# Altium schematic sheet CPU.SchDoc: CPU
size 420 x 297 mm; DocumentNumber: 2; SheetNumber: 3; SheetTotal: 15
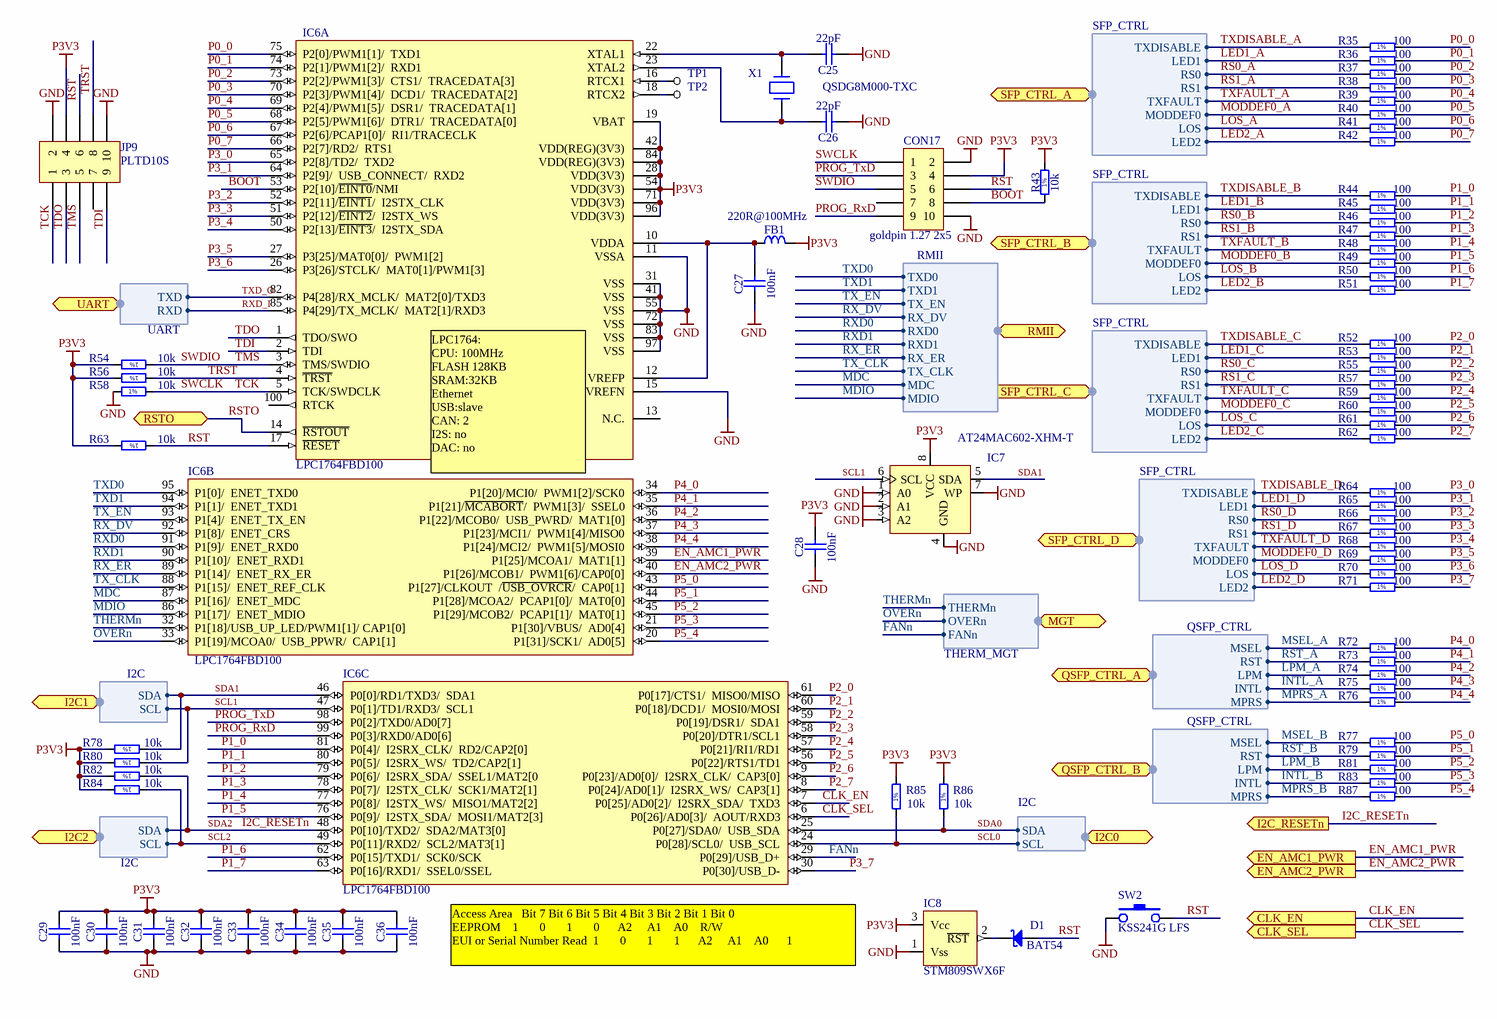
[diagram p0: CPU.SchDoc]

## Parts
C25  22pF  [CAPC1005X55N]
C26  22pF  [CAPC1005X55N]
C27  100nF  [CAPC0603X33N]
C28  100nF  [CAPC0603X33N]
C29  100nF  [CAPC0603X33N]
C30  100nF  [CAPC0603X33N]
C31  100nF  [CAPC0603X33N]
C32  100nF  [CAPC0603X33N]
C33  100nF  [CAPC0603X33N]
C34  100nF  [CAPC0603X33N]
C35  100nF  [CAPC0603X33N]
C36  100nF  [CAPC0603X33N]
CON17  goldpin 1.27 2x5  [CON_2x5_MINI]
D1  BAT54  [SOT95P240X130-3N]
FB1  220R@100MHz  [INDC2012X105N]
IC6  LPC1764FBD100  [LQFP100-LPC]  (parts A,B,C of 3)
IC7  AT24MAC602-XHM-T  [TSSOP-8]
IC8  STM809SWX6F  [SOT-23]
JP9  PLTD10S  [PLTD10S]
R35  100  [RESC1005X40N]
R36  100  [RESC1005X40N]
R37  100  [RESC1005X40N]
R38  100  [RESC1005X40N]
R39  100  [RESC1005X40N]
R40  100  [RESC1005X40N]
R41  100  [RESC1005X40N]
R42  100  [RESC1005X40N]
R43  10k  [RESC1005X40N]
R44  100  [RESC1005X40N]
R45  100  [RESC1005X40N]
R46  100  [RESC1005X40N]
R47  100  [RESC1005X40N]
R48  100  [RESC1005X40N]
R49  100  [RESC1005X40N]
R50  100  [RESC1005X40N]
R51  100  [RESC1005X40N]
R52  100  [RESC1005X40N]
R53  100  [RESC1005X40N]
R54  10k  [RESC1005X40N]
R55  100  [RESC1005X40N]
R56  10k  [RESC1005X40N]
R57  100  [RESC1005X40N]
R58  10k  [RESC1005X40N]
R59  100  [RESC1005X40N]
R60  100  [RESC1005X40N]
R61  100  [RESC1005X40N]
R62  100  [RESC1005X40N]
R63  10k  [RESC1005X40N]
R64  100  [RESC1005X40N]
R65  100  [RESC1005X40N]
R66  100  [RESC1005X40N]
R67  100  [RESC1005X40N]
R68  100  [RESC1005X40N]
R69  100  [RESC1005X40N]
R70  100  [RESC1005X40N]
R71  100  [RESC1005X40N]
R72  100  [RESC1005X40N]
R73  100  [RESC1005X40N]
R74  100  [RESC1005X40N]
R75  100  [RESC1005X40N]
R76  100  [RESC1005X40N]
R77  100  [RESC1005X40N]
R78  10k  [RESC1005X40N]
R79  100  [RESC1005X40N]
R80  10k  [RESC1005X40N]
R81  100  [RESC1005X40N]
R82  10k  [RESC1005X40N]
R83  100  [RESC1005X40N]
R84  10k  [RESC1005X40N]
R85  10k  [RESC1005X40N]
R86  10k  [RESC1005X40N]
R87  100  [RESC1005X40N]
SW2  KSS241G LFS  [KSS241G LFS]
TP1  TP  [TP]  (value not drawn)
TP2  TP  [TP]  (value not drawn)
X1  QSDG8M000-TXC  [XTAL_5.0*3.2]

## Ports
CLK_EN (out), CLK_SEL (out), EN_AMC1_PWR (out), EN_AMC2_PWR (out), I2C0 (harness I2C), I2C1 (harness I2C), I2C2 (harness I2C), I2C_RESETn (out), MGT (harness THERM_MGT), QSFP_CTRL_A (harness QSFP_CTRL), QSFP_CTRL_B (harness QSFP_CTRL), RMII (harness RMII), RSTO, SFP_CTRL_A (harness SFP_CTRL), SFP_CTRL_B (harness SFP_CTRL), SFP_CTRL_C (harness SFP_CTRL), SFP_CTRL_D (harness SFP_CTRL), UART (harness UART)

## Harnesses
I2C: SCL, SDA
UART: RXD, TXD
SFP_CTRL: LED1, TXFAULT, TXDISABLE, MODDEF0, RS0, RS1, LOS, LED2
QSFP_CTRL: RST, MPRS, MSEL, LPM, INTL
RMII: TXD0, TXD1, TX_EN, RX_DV, RXD0, RXD1, RX_ER, TX_CLK, MDC, MDIO
THERM_MGT: OVERn, THERMn, FANn

## Nets
GND: C25.1 C26.1 C27.1 C28.1 C29.1 C30.1 C31.1 C32.1 C33.1 C34.1 C35.1 C36.1 CON17.2 CON17.10 IC6.11(VSSA) IC6.15(VREFN) IC6.31(VSS) IC6.41(VSS) IC6.55(VSS) IC6.72(VSS) IC6.83(VSS) IC6.97(VSS) IC7.1(A0) IC7.2(A1) IC7.3(A2) IC7.4(GND) IC7.7(WP) IC8.1(Vss) JP9.2 JP9.10 R58.1 SW2.1
P3V3: C28.2 C29.2 C30.2 C31.2 C32.2 C33.2 C34.2 C35.2 C36.2 CON17.4 FB1.2 IC6.19(VBAT) IC6.28(VDD(3V3)) IC6.42(VDD(REG)(3V3)) IC6.54(VDD(3V3)) IC6.71(VDD(3V3)) IC6.84(VDD(REG)(3V3)) IC6.96(VDD(3V3)) IC7.8(VCC) IC8.3(Vcc) JP9.4 R43.2 R54.2 R56.2 R63.2 R78.2 R80.2 R82.2 R84.2 R85.2 R86.2
BOOT: CON17.8 IC6.53(P2[10]/~{EINT0}/NMI) R43.1
CLK_EN: IC6.7(P0[25]/AD0[2]/__I2SRX_SDA/__TXD3) ; port CLK_EN
CLK_SEL: IC6.6(P0[26]/AD0[3]/__AOUT/RXD3) ; port CLK_SEL
EN_AMC1_PWR: IC6.39(P1[25]/MCOA1/__MAT1[1]) ; port EN_AMC1_PWR
EN_AMC2_PWR: IC6.40(P1[26]/MCOB1/__PWM1[6]/CAP0[0]) ; port EN_AMC2_PWR
FANn: IC6.29(P0[29]/USB_D+) ; port MGT.FANn
I2C_RESETn: IC6.48(P0[10]/TXD2/__SDA2/MAT3[0]) R82.1 ; port I2C_RESETn, port I2C2.SDA  [also labelled SDA2]
INTL_A: R75.1 ; port QSFP_CTRL_A.INTL
INTL_B: R83.1 ; port QSFP_CTRL_B.INTL
LED1_A: R36.1 ; port SFP_CTRL_A.LED1
LED1_B: R45.1 ; port SFP_CTRL_B.LED1
LED1_C: R53.1 ; port SFP_CTRL_C.LED1
LED1_D: R65.1 ; port SFP_CTRL_D.LED1
LED2_A: R42.1 ; port SFP_CTRL_A.LED2
LED2_B: R51.1 ; port SFP_CTRL_B.LED2
LED2_C: R62.1 ; port SFP_CTRL_C.LED2
LED2_D: R71.1 ; port SFP_CTRL_D.LED2
LOS_A: R41.1 ; port SFP_CTRL_A.LOS
LOS_B: R50.1 ; port SFP_CTRL_B.LOS
LOS_C: R61.1 ; port SFP_CTRL_C.LOS
LOS_D: R70.1 ; port SFP_CTRL_D.LOS
LPM_A: R74.1 ; port QSFP_CTRL_A.LPM
LPM_B: R81.1 ; port QSFP_CTRL_B.LPM
MDC: IC6.87(P1[16]/__ENET_MDC) ; port RMII.MDC
MDIO: IC6.86(P1[17]/__ENET_MDIO) ; port RMII.MDIO
MODDEF0_A: R40.1 ; port SFP_CTRL_A.MODDEF0
MODDEF0_B: R49.1 ; port SFP_CTRL_B.MODDEF0
MODDEF0_C: R60.1 ; port SFP_CTRL_C.MODDEF0
MODDEF0_D: R69.1 ; port SFP_CTRL_D.MODDEF0
MPRS_A: R76.1 ; port QSFP_CTRL_A.MPRS
MPRS_B: R87.1 ; port QSFP_CTRL_B.MPRS
MSEL_A: R72.1 ; port QSFP_CTRL_A.MSEL
MSEL_B: R77.1 ; port QSFP_CTRL_B.MSEL
OVERn: IC6.33(P1[19]/MCOA0/__USB_PPWR/__CAP1[1]) ; port MGT.OVERn
P0_0: IC6.75(P2[0]/PWM1[1]/__TXD1) R35.2
P0_1: IC6.74(P2[1]/PWM1[2]/__RXD1) R36.2
P0_2: IC6.73(P2[2]/PWM1[3]/__CTS1/__TRACEDATA[3]) R37.2
P0_3: IC6.70(P2[3]/PWM1[4]/__DCD1/__TRACEDATA[2]) R38.2
P0_4: IC6.69(P2[4]/PWM1[5]/__DSR1/__TRACEDATA[1]) R39.2
P0_5: IC6.68(P2[5]/PWM1[6]/__DTR1/__TRACEDATA[0]) R40.2
P0_6: IC6.67(P2[6]/PCAP1[0]/__RI1/TRACECLK) R41.2
P0_7: IC6.66(P2[7]/RD2/__RTS1) R42.2
P1_0: IC6.81(P0[4]/__I2SRX_CLK/__RD2/CAP2[0]) R44.2
P1_1: IC6.80(P0[5]/__I2SRX_WS/__TD2/CAP2[1]) R45.2
P1_2: IC6.79(P0[6]/__I2SRX_SDA/__SSEL1/MAT2[0) R46.2
P1_3: IC6.78(P0[7]/__I2STX_CLK/__SCK1/MAT2[1]) R47.2
P1_4: IC6.77(P0[8]/__I2STX_WS/__MISO1/MAT2[2]) R48.2
P1_5: IC6.76(P0[9]/__I2STX_SDA/__MOSI1/MAT2[3]) R49.2
P1_6: IC6.62(P0[15]/TXD1/__SCK0/SCK) R50.2
P1_7: IC6.63(P0[16]/RXD1/__SSEL0/SSEL) R51.2
P2_0: IC6.61(P0[17]/CTS1/__MISO0/MISO) R52.2
P2_1: IC6.60(P0[18]/DCD1/__MOSI0/MOSI) R53.2
P2_2: IC6.59(P0[19]/DSR1/__SDA1) R55.2
P2_3: IC6.58(P0[20]/DTR1/SCL1) R57.2
P2_4: IC6.57(P0[21]/RI1/RD1) R59.2
P2_5: IC6.56(P0[22]/RTS1/TD1) R60.2
P2_6: IC6.9(P0[23]/AD0[0]/__I2SRX_CLK/__CAP3[0]) R61.2
P2_7: IC6.8(P0[24]/AD0[1]/__I2SRX_WS/__CAP3[1]) R62.2
P3_0: IC6.65(P2[8]/TD2/__TXD2) R64.2
P3_1: IC6.64(P2[9]/__USB_CONNECT/__RXD2) R65.2
P3_2: IC6.52(P2[11]/~{EINT1}/__I2STX_CLK) R66.2
P3_3: IC6.51(P2[12]/~{EINT2}/__I2STX_WS) R67.2
P3_4: IC6.50(P2[13]/~{EINT3}/__I2STX_SDA) R68.2
P3_5: IC6.27(P3[25]/MAT0[0]/__PWM1[2]) R69.2
P3_6: IC6.26(P3[26]/STCLK/__MAT0[1]/PWM1[3]) R70.2
P3_7: IC6.30(P0[30]/USB_D-) R71.2
P4_0: IC6.34(P1[20]/MCI0/__PWM1[2]/SCK0) R72.2
P4_1: IC6.35(P1[21]/~{MCABORT}/__PWM1[3]/__SSEL0) R73.2
P4_2: IC6.36(P1[22]/MCOB0/__USB_PWRD/__MAT1[0]) R74.2
P4_3: IC6.37(P1[23]/MCI1/__PWM1[4]/MISO0) R75.2
P4_4: IC6.38(P1[24]/MCI2/__PWM1[5]/MOSI0) R76.2
P5_0: IC6.43(P1[27]/CLKOUT__/~{USB_OVRCR}/__CAP0[1]) R77.2
P5_1: IC6.44(P1[28]/MCOA2/__PCAP1[0]/__MAT0[0]) R79.2
P5_2: IC6.45(P1[29]/MCOB2/__PCAP1[1]/__MAT0[1]) R81.2
P5_3: IC6.21(P1[30]/VBUS/__AD0[4]) R83.2
P5_4: IC6.20(P1[31]/SCK1/__AD0[5]) R87.2
PROG_RxD: CON17.9 IC6.99(P0[3]/RXD0/AD0[6])
PROG_TxD: CON17.3 IC6.98(P0[2]/TXD0/AD0[7])
RS0_A: R37.1 ; port SFP_CTRL_A.RS0
RS0_B: R46.1 ; port SFP_CTRL_B.RS0
RS0_C: R55.1 ; port SFP_CTRL_C.RS0
RS0_D: R66.1 ; port SFP_CTRL_D.RS0
RS1_A: R38.1 ; port SFP_CTRL_A.RS1
RS1_B: R47.1 ; port SFP_CTRL_B.RS1
RS1_C: R57.1 ; port SFP_CTRL_C.RS1
RS1_D: R67.1 ; port SFP_CTRL_D.RS1
RST: CON17.6 D1.1(A) IC6.17(~{RESET}) JP9.6 R63.1 SW2.2
RST_A: R73.1 ; port QSFP_CTRL_A.RST
RST_B: R79.1 ; port QSFP_CTRL_B.RST
RSTO: IC6.14(~{RSTOUT}) ; port RSTO
RX_DV: IC6.92(P1[8]/__ENET_CRS) ; port RMII.RX_DV
RX_ER: IC6.89(P1[14]/__ENET_RX_ER) ; port RMII.RX_ER
RXD0: IC6.91(P1[9]/__ENET_RXD0) ; port RMII.RXD0
RXD1: IC6.90(P1[10]/__ENET_RXD1) ; port RMII.RXD1
RXD_I: IC6.85(P4[29]/TX_MCLK/__MAT2[1]/RXD3) ; port UART.RXD
SCL0: IC6.24(P0[28]/SCL0/__USB_SCL) R85.1 ; port I2C0.SCL
SCL1: IC6.47(P0[1]/TD1/RXD3/__SCL1) IC7.6(SCL) R80.1 ; port I2C1.SCL
SCL2: IC6.49(P0[11]/RXD2/__SCL2/MAT3[1]) R84.1 ; port I2C2.SCL
SDA0: IC6.25(P0[27]/SDA0/__USB_SDA) R86.1 ; port I2C0.SDA
SDA1: IC6.46(P0[0]/RD1/TXD3/__SDA1) IC7.5(SDA) R78.1 ; port I2C1.SDA
SWCLK: CON17.1 IC6.5(TCK/SWDCLK) JP9.1 R58.2  [also labelled TCK]
SWDIO: CON17.5 IC6.3(TMS/SWDIO) JP9.5 R54.1  [also labelled TMS]
TDI: IC6.2(TDI) JP9.9
TDO: IC6.1(TDO/SWO) JP9.3
THERMn: IC6.32(P1[18]/USB_UP_LED/PWM1[1]/_CAP1[0]) ; port MGT.THERMn
TRST: IC6.4(~{TRST}) JP9.8 R56.1
TX_CLK: IC6.88(P1[15]/__ENET_REF_CLK) ; port RMII.TX_CLK
TX_EN: IC6.93(P1[4]/__ENET_TX_EN) ; port RMII.TX_EN
TXD0: IC6.95(P1[0]/__ENET_TXD0) ; port RMII.TXD0
TXD1: IC6.94(P1[1]/__ENET_TXD1) ; port RMII.TXD1
TXD_O: IC6.82(P4[28]/RX_MCLK/__MAT2[0]/TXD3) ; port UART.TXD
TXDISABLE_A: R35.1 ; port SFP_CTRL_A.TXDISABLE
TXDISABLE_B: R44.1 ; port SFP_CTRL_B.TXDISABLE
TXDISABLE_C: R52.1 ; port SFP_CTRL_C.TXDISABLE
TXDISABLE_D: R64.1 ; port SFP_CTRL_D.TXDISABLE
TXFAULT_A: R39.1 ; port SFP_CTRL_A.TXFAULT
TXFAULT_B: R48.1 ; port SFP_CTRL_B.TXFAULT
TXFAULT_C: R59.1 ; port SFP_CTRL_C.TXFAULT
TXFAULT_D: R68.1 ; port SFP_CTRL_D.TXFAULT
NetC25_2: C25.2 IC6.22(XTAL1) X1.1
NetC26_2: C26.2 IC6.23(XTAL2) X1.2
NetC27_2: C27.2 FB1.1 IC6.10(VDDA) IC6.12(VREFP)
NetD1_3: D1.3(C) IC8.2(~{RST})
NetIC6_16: IC6.16(RTCX1) TP1.1
NetIC6_18: IC6.18(RTCX2) TP2.1

Not connected (* = marked no-connect by the designer): CON17 7; IC6 13(N.C.) 100(RTCK); JP9 7

## Notes on the sheet
- (near IC6) LPC1764:
  CPU: 100MHz
  FLASH 128KB
  SRAM:32KB
  Ethernet
  USB:slave
  CAN: 2
  I2S: no
  DAC: no
- Access Area 		Bit 7 Bit 6 Bit 5 Bit 4 Bit 3 Bit 2 Bit 1 Bit 0
  EEPROM 			1       0       1       0      A2     A1    A0    R/W
  EUI or Serial Number Read 	1       0       1       1      A2     A1    A0      1
- Project/Equipment
- Document
- uTCA RTM 8 SFP+
- Designer
- Drawn by
- Check.by
- Copyright Creotech Instruments SA 2014.
  This documentation describes Open Hardware and is licensed under the CERN OHL v.1.1. You may redistribute and modify this documentation under the terms of the CERN OHL v.1.1. (http://ohwr.org/CERNOHL). This documentation is distributed WITHOUT ANY EXPRESS OR IMPLIED WARRANTY, INCLUDING OF MERCHANTABILITY, SATISFACTORY QUALITY AND FITNESS FOR A PARTICULAR PURPOSE. Please see the CERN OHL v.1.1 for applicable conditions.
- Creotech Instruments S.A.
- File
- Last Mod.
- Print Date
- Sheet
- Size
- A3
- of
- Rev
- (in symbol R0402_10K_1%_0.0625W_100PPM) 1%
- (in symbol R0402_100R_1%_0.0625W_100PPM) 1%

## Library data of the parts
C25 C26 = CC0402_22PF_50V_5%_NP0: Non-polarised capacitor; Part Description: SMD Multilayer Chip Ceramic Capacitor; Manufacturer: GENERIC; Manufacturer1 Part Number: 223886915229; Voltage: 50V; TC: NP0; Tolerance: ±5%; Table: Capacitors SMD; Part Number: CC0402_22PF_50V_5%_NP0; Component Kind: Standard; Component Type: Standard; Pin Count: 2; Value: 22pF; Status: Not Recommended; Manufacturer Part Number: CC0402_22PF_50V_5%_NP0; Case: 0402; Mounted: Yes; Socket: No; SMD: Yes; Manufacturer1 Example: PHYCOMP; Manufacturer1 ComponentHeight: 0.55mm; HelpURL: \\cern.ch\dfs\Applications\Altium\Datasheets\CC0402_NP0_PHYCOMP.pdf; Author: CERN DEM JLC; CreateDate: 2007-12-03; LatestRevisionDate: 2007-12-03
C27-C36 = CC0201_100NF_6.3V_10%_X5R: Non-polarised capacitor; Part Description: SMD Multilayer Chip Ceramic Capacitor; Manufacturer: GENERIC; Manufacturer1 Part Number: 02016D104KAT2A; Voltage: 6.3V; TC: X5R; Tolerance: ±10%; Table: Capacitors SMD; Part Number: CC0201_100NF_6.3V_10%_X5R; Component Kind: Standard; Component Type: Standard; Pin Count: 2; Value: 100nF; Status: Not Recommended; Manufacturer Part Number: CC0201_100NF_6.3V_10%_X5R; Case: 0201; Mounted: Yes; Socket: No; SMD: Yes; Manufacturer1 Example: AVX; Manufacturer1 ComponentHeight: 0.33mm; HelpURL: \\cern.ch\dfs\Applications\Altium\Datasheets\CC0201_X5R_AVX.pdf; Author: CERN DEM JLC; CreateDate: 2007-12-03; LatestRevisionDate: 2007-12-03
CON17 = CON_HEADER 5X2: PBTD10S
D1 = BAT54: Diode Schottky  Anode Pin 1 Cathode Pin 3 (Pas de pin 2); Part Description: Single Small Signal Schottky Diode; Manufacturer: FAIRCHILD SEMICONDUCTOR; Voltage: 30V; Power: 200mA; Table: Diodes; Part Number: BAT54; Component Kind: Standard; Component Type: Standard; Device: BAT54; PackageDescription: SOT23 3-Leads, Pitch 0.95mm - Body 1.3x2.9mm, IPC Medium Density; Manufacturer Part Number: BAT54; Pin Count: 3; Case: SOT23-3; Mounted: Yes; Socket: No; SMD: Yes; ComponentHeight: 1.30mm; HelpURL: \\cern.ch\dfs\Applications\Altium\Datasheets\BAT54.pdf; Author: CERN DEM JLC; CreateDate: 2009-09-17; LatestRevisionDate: 2010-05-27
FB1 = IND0805_MURATA_BLM21PG221SN1D: Inductor; Part Description: SMD EMIFIL Suppression Chip Ferrite Bead; Manufacturer: MURATA; Power: 2A; Resistance: 0.05R; Tolerance: ±25%; Table: Inductors SMD; Part Number: IND0805_MURATA_BLM21PG221SN1D; Component Kind: Standard; Component Type: Standard; Pin Count: 2; Value: 220R@100MHz; Status: None; Manufacturer Part Number: BLM21PG221SN1D; Case: 0805; Mounted: Yes; Socket: No; SMD: Yes; ComponentHeight: 1.05mm; HelpURL: \\cern.ch\dfs\Applications\Altium\Datasheets\IND0402_MURATA_BLM21P.pdf; Author: CERN DEM JLC; CreateDate: 2010-01-25; LatestRevisionDate: 2010-01-25
IC6 = UPC_LPC1764: ARM Cortex-M3 procesor
IC7 = MEM_24MAC602: Serial 2K EEPROM+ 48bit MAC
IC8 = VMON_STM809: 2.93V  Reset circuit
JP9 = CON_2x5 2.54 male SMT: Goldpin 2.54mm, male header
R35-R42 R44-R53 R55 R57 R59-R62 R64-R77 R79 R81 R83 R87 = R0402_100R_1%_0.0625W_100PPM: Resistor - 1%; Part Description: General Purpose Thick Film Chip Resistor; Manufacturer: GENERIC; Manufacturer1 Part Number: 232270671001L; TC: ±100ppm/°C; Table: Resistors SMD; Part Number: R0402_100R_1%_0.0625W_100PPM; Component Kind: Standard; Component Type: Standard; Pin Count: 2; Value: 100; Status: Not recommended; Power: 0.0625W; Tolerance: ±1%; Manufacturer Part Number: R0402_100R_1%_0.0625W_100PPM; Case: 0402; Mounted: Yes; Socket: No; SMD: Yes; Manufacturer1 Example: YAGEO PHYCOMP; Manufacturer1 ComponentHeight: 0.4mm; HelpURL: \\cern.ch\dfs\Applications\Altium\Datasheets\R0402_Phycomp_RC0402.pdf; Author: CERN DEM JLC; CreateDate: 2007-12-03; LatestRevisionDate: 2012-10-17
R43 R54 R56 R58 R63 R78 R80 R82 R84-R86 = R0402_10K_1%_0.0625W_100PPM: Resistor - 1%; Part Description: General Purpose Thick Film Chip Resistor; Manufacturer: GENERIC; Manufacturer1 Part Number: 232270671003L; TC: ±100ppm/°C; Table: Resistors SMD; Part Number: R0402_10K_1%_0.0625W_100PPM; Component Kind: Standard; Component Type: Standard; Pin Count: 2; Value: 10k; Status: Not recommended; Power: 0.0625W; Tolerance: ±1%; Manufacturer Part Number: R0402_10K_1%_0.0625W_100PPM; Case: 0402; Mounted: Yes; Socket: No; SMD: Yes; Manufacturer1 Example: YAGEO PHYCOMP; Manufacturer1 ComponentHeight: 0.4mm; HelpURL: \\cern.ch\dfs\Applications\Altium\Datasheets\R0402_Phycomp_RC0402.pdf; Author: CERN DEM JLC; CreateDate: 2007-12-03; LatestRevisionDate: 2012-10-17
SW2 = SW-TACT_SMD_RA_mini: Push button; Supplier 1: Farnell; Supplier Part Number 1: 1437640
TP1 TP2 = TP: Testpoint
X1 = X_CRYSTAL_SMD_5.0*3.2: miniature crystal oscillator (Maritex) QSDG8M000-TXC